# EAGLE schematic Schaltplan (EAGLE 7.1.0)
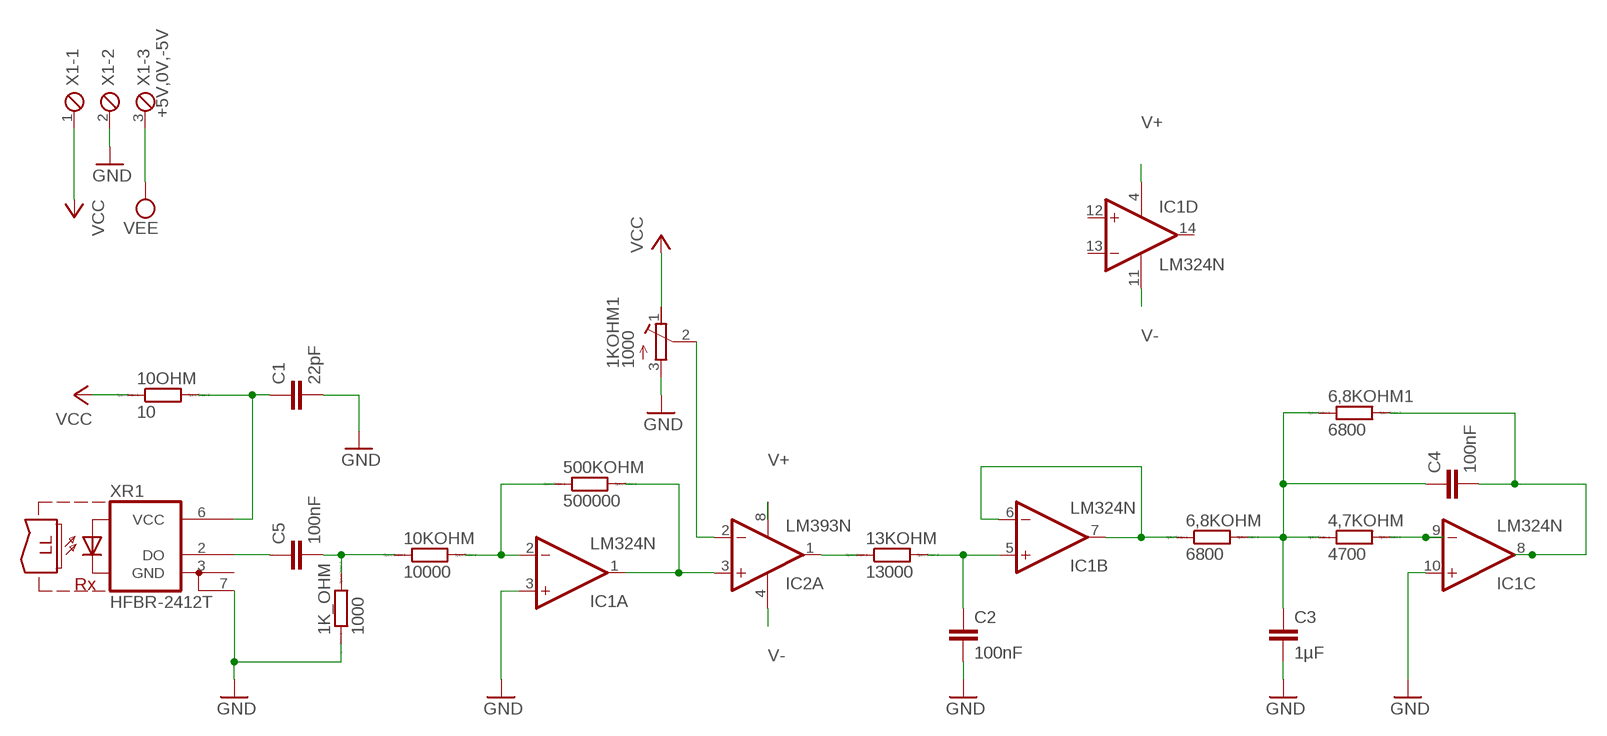
[diagram p0: schematic, sheet 1]

## Parts
1K_OHM  1000  R-EU_0309_12  [0309/12]
1KOHM1  1000  R-TRIMMT93XA  [RTRIMT93XA]
4,7KOHM  4700  R-EU_0309_12  [0309/12]
6,8KOHM  6800  R-EU_0309_12  [0309/12]
6,8KOHM1  6800  R-EU_0309_12  [0309/12]
10KOHM  10000  R-EU_0309_12  [0309/12]
10OHM  10  R-EU_0309_12  [0309/12]
13KOHM  13000  R-EU_0309_12  [0309/12]
500KOHM  500000  R-EU_0309_12  [0309/12]
C1  22pF  C-EU050-024X044  [C050-024X044]
C2  100nF  C2.5/2  [C2.5-2]
C3  1µF  C7.5/3  [C7.5B3]
C4  100nF  C2.5/2  [C2.5-2]
C5  100nF  C2.5/2  [C2.5-2]
IC1  LM324N  [DIL14]
IC2  LM393N  [DIL08]
X1  +5V,0V,-5V  MPT3  [3POL254]
XR1  HFBR-2412T  [HFBR-X41XT]

## Nets
GND: 1K_OHM.1 1KOHM1.3(E) C1.2 C2.2 C3.2 IC1.3(A:+IN) IC1.10(C:+IN) X1.2 XR1.7(GND1)
N$1: 4,7KOHM.1 6,8KOHM1.1 6,8KOHM.2 C3.1 C4.1
N$2: 4,7KOHM.2 IC1.9(C:-IN)
N$3: C5.1 XR1.2(DO)
N$4: 10OHM.2 C1.1 XR1.6(VCC)
N$5: 1K_OHM.2 10KOHM.1 C5.2
N$6: 500KOHM.2 IC1.1(A:OUT) IC2.3(A:+IN)
N$7: 1KOHM1.2(S) IC2.2(A:-IN)
N$8: 13KOHM.1 IC2.1(A:OUT)
N$9: 10KOHM.2 500KOHM.1 IC1.2(A:-IN)
N$10: 13KOHM.2 C2.1 IC1.5(B:+IN)
N$11: 6,8KOHM.1 IC1.6(B:-IN) IC1.7(B:OUT)
N$13: 6,8KOHM1.2 C4.2 IC1.8(C:OUT)
V+: 1KOHM1.1(A) 10OHM.1 IC1.4(P:V+) IC2.8(P:V+) X1.1 ; supply symbol labelled VCC
V-: IC1.11(P:V-) IC2.4(P:V-) X1.3 ; supply symbol labelled VEE
Unconnected: IC1.12(D:+IN) IC1.13(D:-IN) IC1.14(D:OUT) IC2.5(B:+IN) IC2.6(B:-IN) IC2.7(B:OUT)

## Power pins joined to a net without a drawn wire
GND: XR1.3(GND)

## Library data of the parts
1K_OHM 4,7KOHM 6,8KOHM 6,8KOHM1 10KOHM 10OHM 13KOHM 500KOHM = resistor:R-EU_: RESISTOR, European symbol; SPICEPREFIX: R
1KOHM1 = resistor:R-TRIMM: Trimm resistor
C1 = rcl:C-EU: CAPACITOR, European symbol
C2-C5 = capacitor-wima:C: CAPACITOR naming: grid - package width
IC1 = linear:LM324: OP AMP
IC2 = linear:LM393: COMPARATOR
X1 = con-phoenix-254:MPT3: PHOENIX CONNECTOR; OC_FARNELL: unknown; OC_NEWARK: unknown
XR1 = RecieverDiode:HFBR-2412T: RECEIVER low cost miniature fiber optic component, ST housed, TX standard power; MF: AGILENT TECHNOLOGIES; MPN: HFBR-2412T; OC_FARNELL: 1247650; OC_NEWARK: 06F6075